# EasyEDA Pro project ProProject_AT_START_M416_V1.1.epro, board AT-START-M416-V1.1
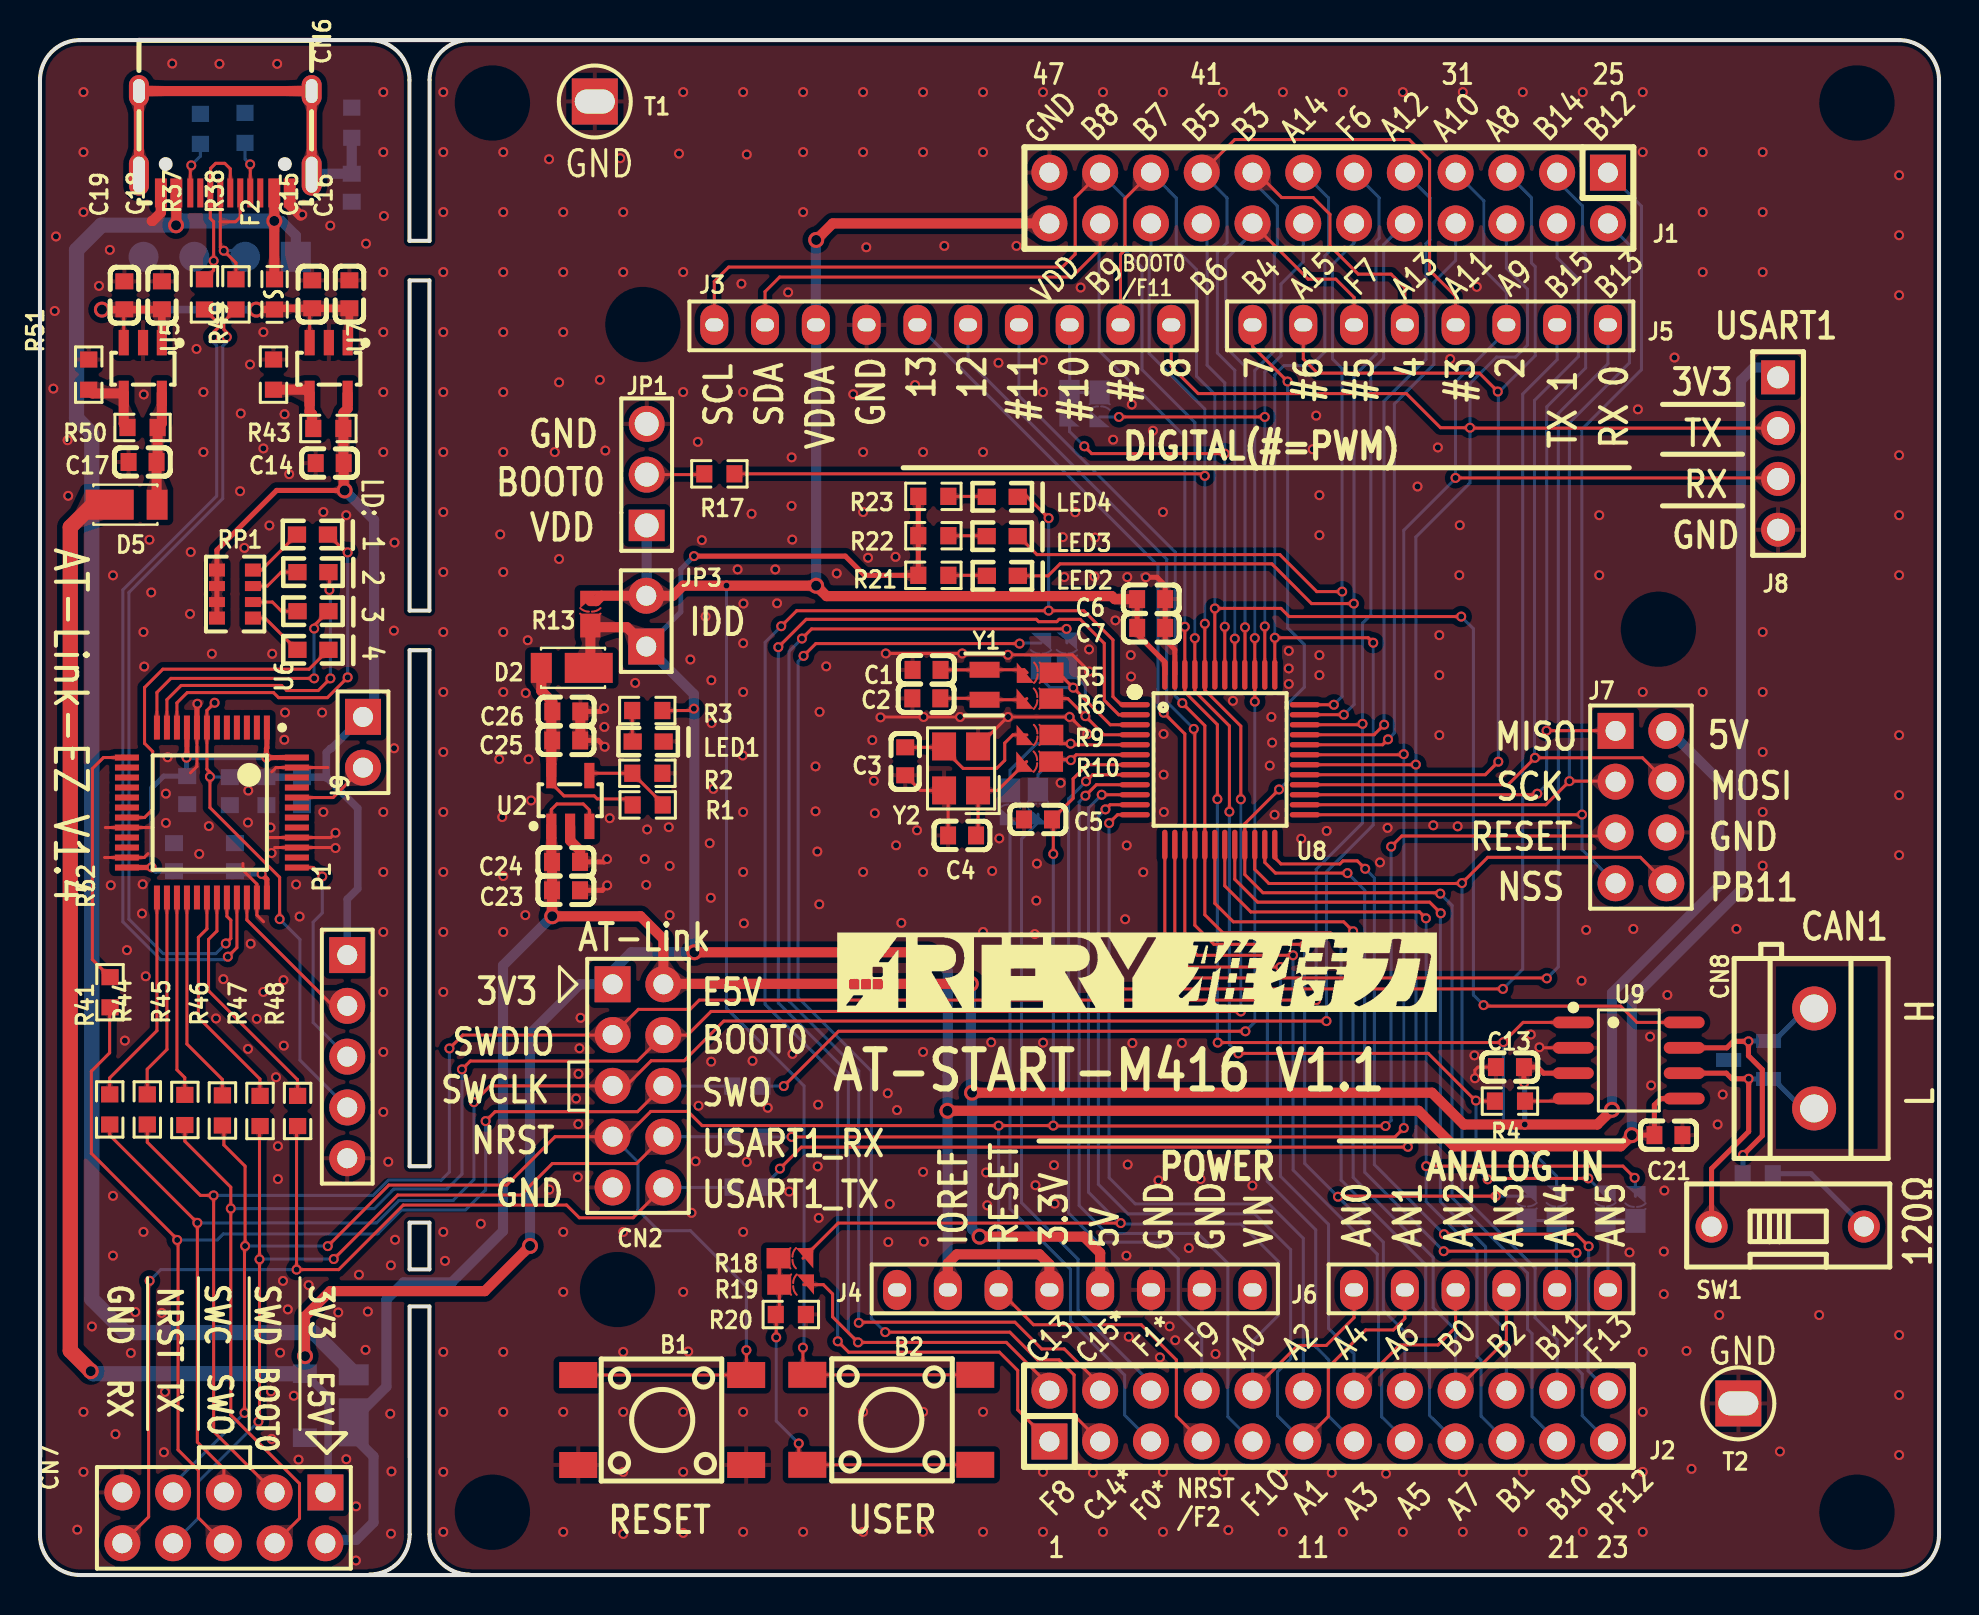
[diagram p4: board, top side]
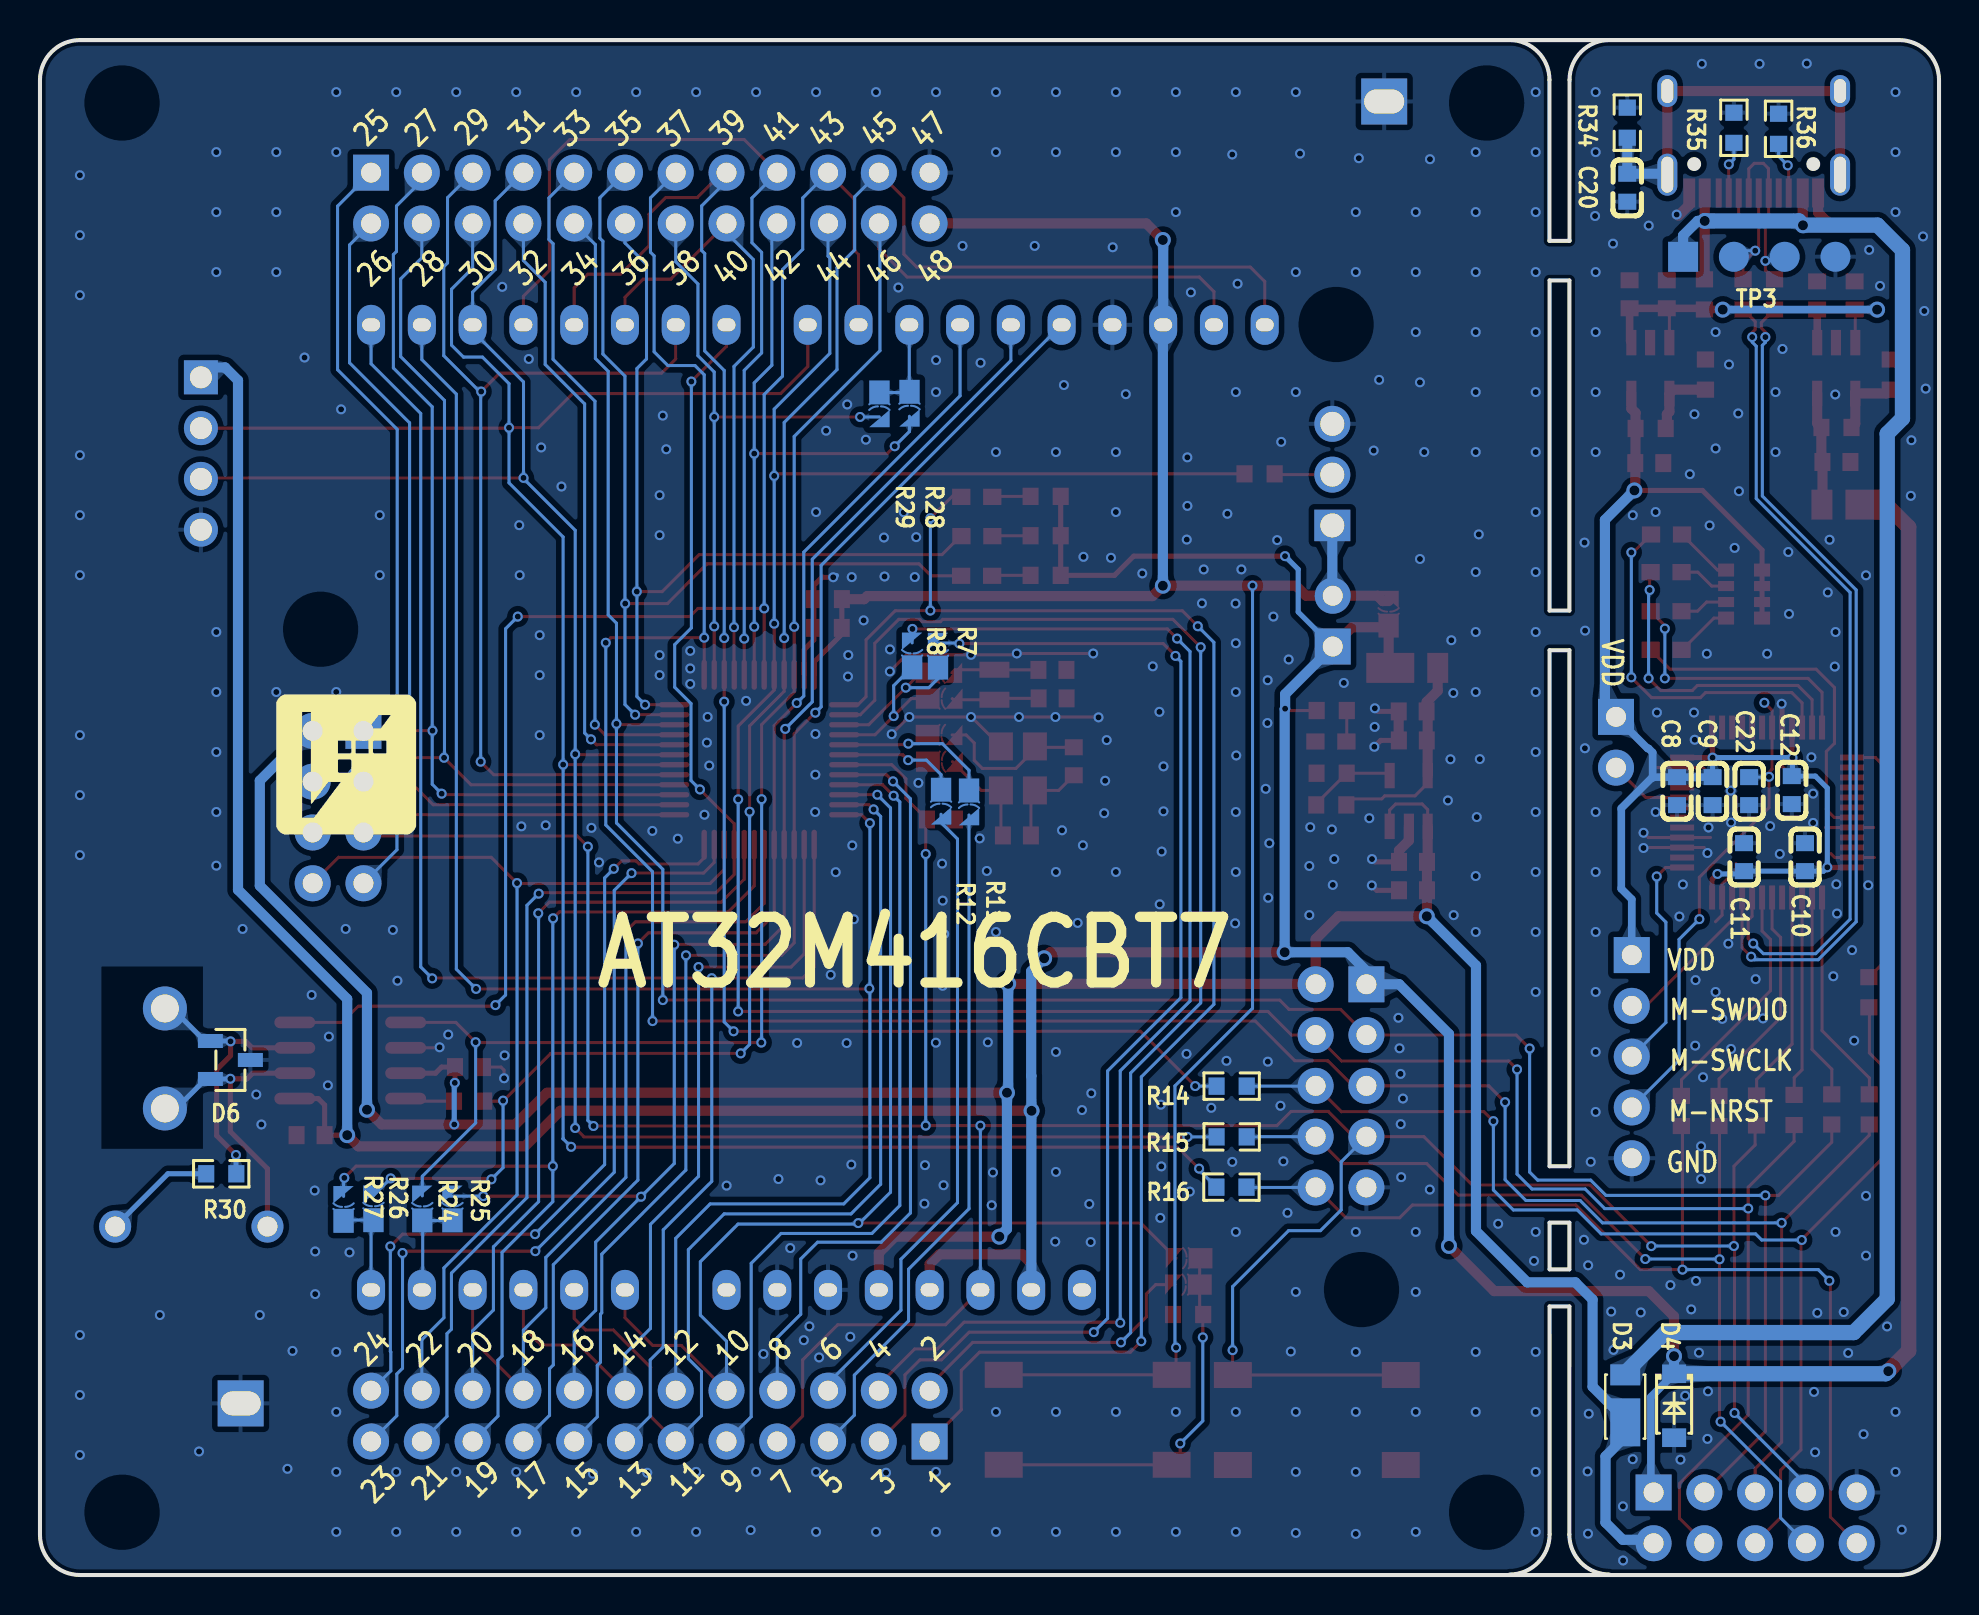
[diagram p5: board, bottom side, seen from below]

Outline 95 x 76.76 mm; copper layers: Top Layer, Bottom Layer. Coordinates in mm from the lower left corner of the outline.
Outline path: 16.48,76.76 arc(17.9,76.18) 18.48,74.76 18.48,66.72 19.49,66.72 19.49,74.76 arc(20.07,76.18) 21.49,76.76 ; 16.49,0.03 arc(17.91,0.61) 18.49,2.03 18.49,13.43 19.48,13.43 19.48,2.03 arc(20.07,0.61) 21.48,0.02 ; 0,74.76 0,2 arc(0.59,0.59) 2,0 93,0 arc(94.41,0.59) 95,2 95,74.76 arc(94.41,76.17) 93,76.76 2,76.76 arc(0.59,76.17) 0,74.76 ; 18.49,64.74 19.48,64.74 19.48,48.23 18.49,48.23 18.49,64.74 ; 18.49,46.25 19.48,46.25 19.48,20.44 18.49,20.44 18.49,46.25 ; 18.49,17.62 19.48,17.62 19.48,15.29 18.49,15.29 18.49,17.62
Stack: Top Layer 0.0356mm / Dielectric1 0.32mm FR-4 er 4.8 / Bottom Layer 0.0356mm

## Design rules (mm)
template: 自定义配置
spacing copperThickness1oz (default): track to track 0.152, other pairs 0.152 to 0.3
track width copperThickness1oz (default): min 0.127, default 0.152, max 2.54
differential pair differentialPair (default): width min 0.127, default 0.254, max 2.54; gap min 0.152, default 0.152
via viaSize (default): diameter min 0.5, default 0.5, max 1.001; hole min 0.3, default 0.3, max 0.701

## Placement (name value [footprint] x y rotation side)
B1  TS-1002S-05026C  [KEY-SMD_4P-L6.0-W6.0-P4.50-LS9.0]  31.12 7.75 0 top
B2  TSA063G60-250  [KEY-SMD_4P-L6.1-W6.1-P4.50-LS9.0]  42.59 7.76 180 top
C1  18pF  [C0603]  44.35 45.26 0 top
C2  18pF  [C0603]  44.34 43.84 0 top
C3  15pF  [C0603]  43.28 40.69 90 top
C4  15pF  [C0603]  46.13 36.98 0 top
C5  100nF  [C0603]  49.92 37.78 0 top
C6  4.7uF  [C0603]  55.58 48.8 180 top
C7  100nF  [C0603]  55.59 47.37 180 top
C8  4.7uF  [C0603]  13.11 39.2 90 bottom
C9  100nF  [C0603]  11.33 39.2 90 bottom
C10  100nF  [C0603]  6.7 35.9 270 bottom
C11  100nF  [C0603]  9.75 35.9 270 bottom
C12  100nF  [C0603]  7.37 39.25 90 bottom
C13  100nF  [C0603]  73.53 25.4 0 top
C14  10uF  [C0603]  14.49 55.6 0 top
C15  10uF  [C0603]  13.62 64.04 270 top
C16  100nF  [C0603]  15.48 64.05 270 top
C17  10uF  [C0603]  5.13 55.66 0 top
C18  10uF  [C0603]  6.1 63.99 270 top
C19  100nF  [C0603]  4.22 63.99 270 top
C20  100nF  [C0603]  15.59 69.38 90 bottom
C21  100nF  [C0603]  81.46 22 180 top
C22  100nF  [C0603]  9.5 39.2 90 bottom
C23  10uF  [C0603]  26.31 34.24 0 top
C24  100nF  [C0603]  26.31 35.66 0 top
C25  10uF  [C0603]  26.32 41.74 0 top
C26  100nF  [C0603]  26.33 43.19 0 top
CN2  CON10  [HDR2X5]  28.64 29.54 270 top
CN6  -  [USB-C-SMD_TYPEC-304-BCP16]  9.27 71.66 180 top
CN7  CON10  [HDR2X5]  14.28 4.13 180 top
CN8  KF301-5.0-2P  [CONN-TH_P5.00_KF301-5.0-2P]  88.75 25.83 90 top
D2  DFLS130L-7  [POWERDI-123_L2.8-W1.8-LS3.7-RD]  26.26 45.36 180 top
D3  DFLS130L-7  [POWERDI-123_L2.8-W1.8-LS3.7-RD]  15.7 8.82 90 bottom
D4  SMF3.3A  [SOD-123FL_L2.8-W1.8-LS3.8-RD]  13.25 8.47 270 bottom
D5  DFLS130L-7  [POWERDI-123_L2.8-W1.8-LS3.7-RD]  4.67 53.53 0 top
D6  PESD2CANFD24V-TR  [SOT-23-3_L2.9-W1.3-P1.90-LS2.4-BR]  85.47 25.76 0 bottom
F2  BSMD0603-050-6V  [F0603]  11.73 64.04 270 top
J1  Header 12X2  [HEAD2*12]  78.43 70.13 180 top
J2  Header 12X2  [HEAD2*12]  50.49 6.68 0 top
J3  CON10  [HDR1X10 - 2#]  56.59 62.52 180 top
J4  CON8  [HDR1X8 - 2#]  42.87 14.26 0 top
J5  CON8  [HDR1X8 - 2#]  78.43 62.52 180 top
J6  CON6  [HDR1X6 -2#]  65.73 14.26 0 top
J7  Header 4X2  [HDR2X4]  78.81 42.21 270 top
J8  PZ2.54-1*4-WZ  [HDR-TH_4P-P2.54-H-M-W7.7-P]  86.95 56.08 270 top
J9  1X2P_2.54M  [HDR1X2]  16.16 42.91 270 top
JP1  2.54-1*3P针  [HDR-TH_3P-P2.54-V-M-1]  30.35 55.03 90 top
JP3  1X2P_2.54M  [HDR1X2]  30.33 46.43 90 top
LD1  RED  [LED0603]  12.86 52.03 0 top
LD2  GREEN  [LED0603]  12.88 50.15 0 top
LD3  BLUE  [LED0603]  12.88 48.19 0 top
LD4  YELLOW  [LED0603]  12.88 46.26 0 top
LED1  RED  [LED0603]  29.65 41.68 0 top
LED2  RED  [LED0603]  47.37 49.96 0 top
LED3  YELLOW  [LED0603]  47.36 51.94 0 top
LED4  GREEN  [LED0603]  47.36 53.91 0 top
P1  Header 5  [HDR1X5]  15.37 31 270 top
R1  51kΩ  [R0603]  30.4 38.51 0 top
R2  15kΩ  [R0603]  30.38 40.09 0 top
R3  1kΩ  [R0603]  30.38 43.23 0 top
R4  330Ω  [R0603]  73.53 23.7 0 top
R5  0Ω  [SB-PAD_2]  50.02 45.12 0 top
R6  0Ω  [SB-PAD_2]  50.01 43.83 0 top
R7  NC  [SB-PAD_2]  50.07 45.96 270 bottom
R8  NC  [SB-PAD_2]  51.37 45.97 270 bottom
R9  0Ω  [SB-PAD_2]  50.01 42.01 0 top
R10  0Ω  [SB-PAD_2]  50 40.68 0 top
R11  NC  [SB-PAD_2]  48.52 38.65 90 bottom
R12  NC  [SB-PAD_2]  49.92 38.69 90 bottom
R13  0Ω  [SB-PAD_2]  27.53 48.06 270 top
R14  470Ω  [R0603]  35.38 24.45 180 bottom
R15  470Ω  [R0603]  35.39 21.91 180 bottom
R16  470Ω  [R0603]  35.4 19.4 180 bottom
R17  3.3kΩ  [R0603]  33.99 55.07 180 top
R18  0Ω  [SB-PAD_2]  37.52 15.84 180 top
R19  NC  [SB-PAD_2]  37.56 14.52 180 top
R20  100kΩ  [R0603]  37.56 13.03 0 top
R21  1kΩ  [R0603]  44.69 49.99 180 top
R22  1kΩ  [R0603]  44.69 51.97 180 top
R23  1kΩ  [R0603]  44.69 53.94 180 top
R24  NC  [SB-PAD_2]  75.87 18.31 270 bottom
R25  0Ω  [SB-PAD_2]  74.36 18.31 270 bottom
R26  NC  [SB-PAD_2]  78.31 18.32 270 bottom
R27  0Ω  [SB-PAD_2]  79.81 18.29 270 bottom
R28  NC  [SB-PAD_2]  51.5 58.59 90 bottom
R29  0Ω  [SB-PAD_2]  53.01 58.56 90 bottom
R30  120Ω  [R0603]  85.93 20.07 180 bottom
R34  1MΩ  [R0603]  15.59 72.63 90 bottom
R35  5.1kΩ  [R0603]  10.26 72.37 90 bottom
R36  5.1kΩ  [R0603]  8.03 72.32 90 bottom
R37  0Ω  [R0603]  8.23 64.04 270 top
R38  0Ω  [R0603]  9.8 64.04 270 top
R41  33Ω  [R0603]  3.49 23.28 270 top
R43  47kΩ  [R0603]  14.43 57.34 180 top
R44  33Ω  [R0603]  5.37 23.28 270 top
R45  33Ω  [R0603]  7.25 23.26 270 top
R46  33Ω  [R0603]  9.13 23.23 270 top
R47  33Ω  [R0603]  11.01 23.21 270 top
R48  33Ω  [R0603]  12.89 23.21 270 top
R49  15kΩ  [R0603]  11.68 60.03 90 top
R50  51kΩ  [R0603]  5.13 57.39 180 top
R51  15kΩ  [R0603]  2.44 60.03 90 top
R52  33Ω  [R0603]  3.5 29.14 270 top
RP1  1kΩ  [RES-ARRAY-SMD_0603-8P-L3.2-W1.6-BL]  9.75 49.06 270 top
SW1  DSWB01LHGET  [SW-TH_DSWB01LHGET]  87.43 17.42 90 top
T1  Test point  [TestPoint]  27.75 73.69 0 top
T2  Test point  [TestPoint]  84.96 8.58 0 top
TP3  1X4P_2.54F  [HDR1X4 - TOP]  12.8 65.92 0 bottom
U2  RT9080N-08GJ5  [SOT-23-5]  28.12 39.09 90 top
U5  RT9080N-08GJ5  [SOT-23-5]  3.56 59.98 270 top
U6  AT32F403ACCT7  [LQFP48 - 2]  11.35 42.38 270 top
U7  RT9080N-08GJ5  [SOT-23-5]  12.85 59.98 270 top
U8  -  [LQFP-48_L7.0-W7.0-P0.50-LS9.0-BL]  59.02 40.77 270 top
U9  MCP2562FD-E/SN  [SOIC-8_L4.9-W3.9-P1.27-LS6.0-BL]  79.48 25.73 270 top
Y1  32.768KHz  [XTAL_SOP - FC-12M]  47.25 45.27 270 top
Y2  8MHz  [CRYSTAL-SMD_4P-L3.2-W2.5-BL]  46.08 40.34 90 top

## Footprints (pads in the part's own frame, mm; a bottom-side part is the same pattern mirrored in y, then rotated)
C0603
  rect 0.8x0.9 smd: 1(-0.7,0) 2(0.7,0)
CONN-TH_P5.00_KF301-5.0-2P
  round 2.2 hole 1.4: 1(-2.5,0) 2(2.5,0)
CRYSTAL-SMD_4P-L3.2-W2.5-BL
  rect 1.4x1.2 smd: 1(-1.1,-0.85) 2(1.1,-0.85) 3(1.1,0.85) 4(-1.1,0.85)
F0603
  rect 0.806x0.864 smd: 1(-0.753,0) 2(0.753,0)
HDR1X2
  rect 1.8x1.8 hole 1: 1(0,0)
  round 1.8 hole 1: 2(2.54,0)
HDR1X4 - TOP
  rect 1.5x1.5 smd: 1(0,0)
  round 1.5 smd: 2(-2.54,0) 3(-5.08,0) 4(-7.62,0)
HDR1X5
  rect 1.8x1.8 hole 1: 1(0,0)
  round 1.8 hole 1: 2(2.54,0) 3(5.08,0) 4(7.62,0) 5(10.16,0)
HDR1X6 -2#
  oval 1.4x2 hole 0.9x0.65: 1(0,0) 2(2.54,0) 3(5.08,0) 4(7.62,0) 5(10.16,0) 6(12.7,0)
HDR1X8 - 2#
  oval 1.4x2 hole 0.9x0.65: 1(0,0) 2(2.54,0) 3(5.08,0) 4(7.62,0) 5(10.16,0) 6(12.7,0) 7(15.24,0) 8(17.78,0)
HDR1X10 - 2#
  oval 1.4x2 hole 0.9x0.65: 1(0,0) 2(2.54,0) 3(5.08,0) 4(7.62,0) 5(10.16,0) 6(12.7,0) 7(15.24,0) 8(17.78,0) 9(20.32,0) 10(22.86,0)
HDR2X4
  rect 1.8x1.8 hole 1: 1(0,0)
  round 1.8 hole 1: 2(0,2.54) 3(2.54,0) 4(2.54,2.54) 5(5.08,0) 6(5.08,2.54) 7(7.62,0) 8(7.62,2.54)
HDR2X5
  rect 1.8x1.8 hole 1: 1(0,0)
  round 1.8 hole 1: 2(0,2.54) 3(2.54,0) 4(2.54,2.54) 5(5.08,0) 6(5.08,2.54) 7(7.62,0) 8(7.62,2.54) 9(10.16,0) 10(10.16,2.54)
HDR-TH_3P-P2.54-V-M-1
  rect 1.575x1.8 hole 1.2: 1(-2.54,0)
  round 1.8 hole 1.2: 2(0,0) 3(2.54,0)
HDR-TH_4P-P2.54-H-M-W7.7-P
  rect 1.7x1.7 hole 1.1: 1(-3.81,0)
  round 1.7 hole 1.1: 2(-1.27,0) 3(1.27,0) 4(3.81,0)
HEAD2*12
  rect 1.8x1.8 hole 1: 1(0,0)
  round 1.8 hole 1: 2(0,2.54) 3(2.54,0) 4(2.54,2.54) 5(5.08,0) 6(5.08,2.54) 7(7.62,0) 8(7.62,2.54) 9(10.16,0) 10(10.16,2.54) 11(12.7,0) 12(12.7,2.54) 13(15.24,0) 14(15.24,2.54) 15(17.78,0) 16(17.78,2.54) 17(20.32,0) 18(20.32,2.54) 19(22.86,0) 20(22.86,2.54) 21(25.4,0) 22(25.4,2.54) 23(27.94,0) 24(27.94,2.54)
KEY-SMD_4P-L6.0-W6.0-P4.50-LS9.0
  rect 1.9x1.3 smd: 1(-4.2,2.25) 2(4.2,2.25) 3(-4.2,-2.25) 4(4.2,-2.25)
KEY-SMD_4P-L6.1-W6.1-P4.50-LS9.0
  rect 1.9x1.3 smd: 1(-4.2,2.25) 2(4.2,2.25) 3(-4.2,-2.25) 4(4.2,-2.25)
LED0603
  rect 0.914x0.813 smd: 1(-0.001,0.005) 2(1.548,0.005)
LQFP48 - 2
  rect 1.2x0.3 smd: 1(0,0) 2(0,-0.5) 3(0,-1) 4(0,-1.5) 5(0,-2) 6(0,-2.5) 7(0,-3) 8(0,-3.5) 9(0,-4) 10(0,-4.5) 11(0,-5) 12(0,-5.5) 25(8.5,-5.5) 26(8.5,-5) 27(8.5,-4.5) 28(8.5,-4) 29(8.5,-3.5) 30(8.5,-3) 31(8.5,-2.5) 32(8.5,-2) 33(8.5,-1.5) 34(8.5,-1) 35(8.5,-0.5) 36(8.5,0)
  rect 0.3x1.2 smd: 13(1.5,-7) 14(2,-7) 15(2.5,-7) 16(3,-7) 17(3.5,-7) 18(4,-7) 19(4.5,-7) 20(5,-7) 21(5.5,-7) 22(6,-7) 23(6.5,-7) 24(7,-7) 37(7,1.5) 38(6.5,1.5) 39(6,1.5) 40(5.5,1.5) 41(5,1.5) 42(4.5,1.5) 43(4,1.5) 44(3.5,1.5) 45(3,1.5) 46(2.5,1.5) 47(2,1.5) 48(1.5,1.5)
LQFP-48_L7.0-W7.0-P0.50-LS9.0-BL
  oval 0.269x1.501 smd: 1(-2.751,-4.25) 2(-2.251,-4.25) 3(-1.75,-4.25) 4(-1.25,-4.25) 5(-0.75,-4.25) 6(-0.249,-4.25) 7(0.249,-4.25) 8(0.75,-4.25) 9(1.25,-4.25) 10(1.75,-4.25) 11(2.251,-4.25) 12(2.751,-4.25) 25(2.751,4.25) 26(2.251,4.25) 27(1.75,4.25) 28(1.25,4.25) 29(0.75,4.25) 30(0.249,4.25) 31(-0.249,4.25) 32(-0.75,4.25) 33(-1.25,4.25) 34(-1.75,4.25) 35(-2.251,4.25) 36(-2.751,4.25)
  oval 1.501x0.269 smd: 13(4.25,-2.751) 14(4.25,-2.251) 15(4.25,-1.75) 16(4.25,-1.25) 17(4.25,-0.75) 18(4.25,-0.249) 19(4.25,0.249) 20(4.25,0.75) 21(4.25,1.25) 22(4.25,1.75) 23(4.25,2.251) 24(4.25,2.751) 37(-4.25,2.751) 38(-4.25,2.251) 39(-4.25,1.75) 40(-4.25,1.25) 41(-4.25,0.75) 42(-4.25,0.249) 43(-4.25,-0.249) 44(-4.25,-0.75) 45(-4.25,-1.25) 46(-4.25,-1.75) 47(-4.25,-2.251) 48(-4.25,-2.751)
POWERDI-123_L2.8-W1.8-LS3.7-RD
  rect 2.4x1.5 smd: 1(-1.188,0)
  rect 1.05x1.5 smd: 2(1.188,0)
R0603
  rect 0.806x0.864 smd: 1(-0.753,0) 2(0.753,0)
RES-ARRAY-SMD_0603-8P-L3.2-W1.6-BL
  rect 0.65x0.8 smd: 1(-1.2,-0.9) 4(1.2,-0.9) 5(1.2,0.9) 8(-1.2,0.9)
  rect 0.5x0.8 smd: 2(-0.4,-0.9) 3(0.4,-0.9) 6(0.4,0.9) 7(-0.4,0.9)
SB-PAD_2
  custom 1.042x1.016 smd: 1(-0.64,-0.002)
  custom 1.194x1.016 smd: 2(0.579,-0.002)
SOD-123FL_L2.8-W1.8-LS3.8-RD
  rect 0.93x1.2 smd: 1(-1.6,0) 2(1.6,0)
SOIC-8_L4.9-W3.9-P1.27-LS6.0-BL
  oval 0.588x2.045 smd: 1(-1.905,-2.772) 2(-0.635,-2.772) 3(0.635,-2.772) 4(1.905,-2.772) 5(1.905,2.772) 6(0.635,2.772) 7(-0.635,2.772) 8(-1.905,2.772)
SOT-23-3_L2.9-W1.3-P1.90-LS2.4-BR
  rect 1.25x0.7 smd: 1(1,-0.95) 2(1,0.95) 3(-1,0)
SOT-23-5
  rect 1.27x0.508 smd: 1(-1.651,2.54) 2(-1.651,1.6) 3(-1.651,0.635) 4(0.889,0.635) 5(0.889,2.54)
SW-TH_DSWB01LHGET
  round 1.6 hole 1: 1(0,3.81) 2(0,-3.81)
TestPoint
  rect 2.3x2.3 hole 2x1.2: 1(0,0)
USB-C-SMD_TYPEC-304-BCP16
  oval 1.001x2.1 hole 0.6x1.801: 13(-4.321,1.633) 14(4.321,1.633)
  oval 1.001x1.6 hole 0.6x1.199: 15(-4.321,-2.547) 16(4.321,-2.547)
  rect 0.6x1.45 smd: A1B12(-3.226,2.547) A4B9(-2.451,2.547) B1A12(3.22,2.547) B4A9(2.451,2.547)
  rect 0.299x1.45 smd: A5(-1.25,2.547) A6(-0.249,2.547) A7(0.249,2.547) A8(1.25,2.547) B5(1.75,2.547) B6(0.75,2.547) B7(-0.75,2.547) B8(-1.75,2.547)
XTAL_SOP - FC-12M
  rect 0.8x1.5 smd: 1(0,0) 2(1.5,0)

## Nets
As in the schematic.

Pads without a net: CN6 A8 B8; J4 1 8; U6 2 3 4 5 6 14 15 16 17 18 21 22 29 38 41 42 43 45 46

## Via types
v1: diameter 0.8, hole 0.5, Top Layer to Bottom Layer, 19 vias
v2: diameter 0.5, hole 0.299, Top Layer to Bottom Layer, 111 vias
v3: diameter 0.5, hole 0.3, Top Layer to Bottom Layer, 541 vias

## Routing (per net, layer and track width the routed paths; a pad name or vN(x,y) marks a point on that pad's centre or on a via; arc(x,y) is an arc through that point)
3V3: length 262.2
  Top Layer w0.152: v3(32.71,43.32) 32.62,43.23 R3.2
  Top Layer w0.254: 43.94,54.11 43.94,49.99 41.25,49.99 40.28,50.95 v2(32.72,50.95) ; U9.5 81.08,23.83 80.76,23.51 C21.2 v1(79.63,22)
  Top Layer w0.508: JP3.1 29.36,47.4 27.62,47.4 27.53,47.49 27.53,45.45 D2.1 ; 45.4,23.22 68.96,23.22 70.74,21.44 79.07,21.44 v1(79.63,22) ; v1(44.77,30.84) 44.46,31.14 v1(32.73,31.14) ; 45.41,14.26 45.41,15.59 45.86,16.04 50,16.04 50.49,15.54 J4.4 ; v1(13.26,10.95) 13.26,12.94 14.52,14.2 22.25,14.2 v1(24.51,16.46)
  Top Layer w0.762: v1(2.54,10.19) 1.52,11.22 1.52,52.4 2.64,53.53 D5.1
  Bottom Layer w0.254: v2(32.72,50.95) 32.06,50.29 32.06,48.16 JP3.1
  Bottom Layer w0.381: CN7.1 14.41,4.26 14.41,8.9 D4.1
  Bottom Layer w0.508: v1(79.63,22) 79.63,28.8 85.09,34.27 85.09,59.74 85.74,60.39 86.45,60.39 J8.1 ; JP3.1 32.71,44.05 v3(32.71,43.32) 32.73,43.3 v1(32.73,31.14) 29.57,31.14 28.64,30.21 CN2.1 27,29.54 24.51,27.05 v1(24.51,16.46) ; 45.41,14.26 45.4,14.27 45.4,24.96 45.41,24.97 45.41,30.19 v1(44.77,30.84) ; D4.1 13.26,10.07 v1(13.26,10.95)
  Bottom Layer w0.762: D4.1 2.67,10.06 v1(2.54,10.19)
  vias: v1(45.4,23.21)
GND: length 70.1
  Top Layer w0.152: C13.1 71.93,25.4 71.78,25.25 v2(71.78,24.84) ; 10.15,35.58 10.15,35.25 10.85,34.55 U6.35 10.85,33 11.18,32.67 ; U6.8 7.85,40.43 7.53,40.11 ; 14.4,40.38 U6.47 11.81,40.38 11.59,40.17 ; v2(52.48,45.18) 51.65,46.02 v2(48.42,46.02) 46.2,46.02 v2(46.13,46.08) v2(42.31,46.08) ; C3.1 44.04,39.24 Y2.4 45.43,39.03 C4.1 ; v2(52.39,42.05) 51.73,42.71 51.73,42.72 51.54,42.91 v2(51.51,42.91) v3(48.42,42.91) 48.4,42.91 ; 3.23,35.88 U6.23 5.21,35.88 5.41,36.08 ; 11.74,36.38 U6.39 14.76,36.38 v3(14.78,36.36) ; 48.4,42.91 v2(46.02,42.91) v2(44.2,42.91) 42.06,42.91 v2(42.04,42.89) ; 48.4,42.91 46.93,41.44 ; v2(75.01,26.39) 75.03,26.37 U9.2 ; 11.43,36.88 U6.40 14.55,36.88 v3(14.78,37.12) ; 3.27,37.38 U6.20 5.68,37.38
  Top Layer w0.254: v2(28.25,41.42) 27.93,41.74 C25.2 ; v2(28.37,34.49) 28.13,34.24 C23.2 ; v3(28.22,43.34) 28.06,43.19 C26.2 ; v2(28.37,35.8) 28.22,35.66 C24.2 ; C7.1 56.28,46.76 56.77,46.28 U8.47 ; v3(7.87,43.57) 7.85,43.55 U6.8 ; v3(55.32,49.9) 55.88,49.9 56.28,49.49 C6.1 56.28,47.37
  Top Layer w0.508: U2.2 26.52,36.73 27.01,36.23 C24.2 ; CN6.B1A12 6.05,68.13 5.63,67.71 5.59,67.71 ; 13.04,67.98 12.5,68.52 CN6.A1B12 ; C26.2 27.03,41.75 C25.2
  Bottom Layer w0.254: v3(55.32,49.9) 55.24,49.9 55.15,49.99
  vias: v2(28.23,42.41) v2(28.5,37.85) v2(29.77,44.61) v2(33.6,42.61) v2(33.68,39.32) v2(34.9,50.29) v2(35.6,53.07) v2(36.78,50.29) v2(37.64,26.06) v2(39.86,50.09) v2(53.8,47.74) v2(54.56,46) v2(54.58,44.93) v2(64,54) v2(64,52) v2(64,46) v2(64,45) v2(64.36,37.21) v2(67.03,35.64) v2(67.41,37.36) v2(68.91,54.43) v2(69.7,37.49) v2(69.93,56.39) v2(70,47) v2(70,45) v2(70,42) v2(71,50) v2(70.92,37.44) v2(71.02,52.5) v2(71.75,25.98) v2(74.57,27.03) v2(77.11,29.72) v2(77.34,32.26) v2(78,53) v2(78,50) v2(79.71,32.31) v2(79.93,58.29) v2(80.54,26.92) v2(80.59,24.49) v2(81.25,19.23) v2(81.23,16.18) v2(81.23,14.05) v2(81.41,29.01) v2(81.76,60.88) v2(83.92,22.53) v2(84,13) v2(84.18,24.03) v2(84.86,32.31) v2(89,13) v3(0.67,59.33) v3(0.8,66.94) v3(0.74,63.21) v3(1.38,56.75) v3(1.41,53.97) v3(1.86,2.27) v3(2.18,74.16) v3(2.18,71.16) v3(2.18,68.16) v3(2.18,8.16) v3(2.18,5.16) v3(2.6,12.43) v3(2.95,64.47) v3(3.49,66.27) v3(3.54,34.49) v3(3.65,49.99) v3(3.65,18.96) v3(3.65,15.97) v3(3.78,7.04) v3(4.25,26.72) v3(4.35,31.25) v3(4.55,11.1) v3(4.77,13.15) v3(5.19,59.04) v3(5.18,47.16) v3(5.14,34.54) v3(5.1,33.08) v3(5.18,17.16) v3(5.21,45.43) v3(5.29,29.94) v3(5.48,51.77) v3(5.56,49.14) v3(6.09,13.11) v3(6.2,6.14) v3(6.3,39.08) v3(6.3,37.61) v3(6.25,9.16) v3(6.39,40.89) v3(6.62,75.59) v3(7.54,51.16) v3(7.51,48.06) v3(7.83,61.31) v3(7.97,36.06) v3(8.18,59.16) v3(8.18,56.16) v3(8.45,37.45) v3(8.6,46.07) v3(8.81,27.83) v3(8.98,75.57) v3(9.17,29.8) v3(10.04,58.09) v3(10.01,54.2) v3(10.22,51.37) v3(10.42,39.23) v3(10.4,37.63) v3(10.41,26.31) v3(10.51,60.54) v3(10.54,31.57) v3(10.84,27.81) v3(11.18,62.16) v3(11.18,56.34) v3(11.18,29.16) v3(11.48,52.49) v3(11.53,37.38) v3(11.59,36.1) v3(11.56,9.19) v3(11.58,6.81) v3(11.62,46.07) v3(11.86,75.57) v3(11.81,24.89) v3(11.9,21.44) v3(11.9,19.8) v3(12.01,11.12) v3(12.18,29.75) v3(12.2,26.47) v3(12.16,14.71) v3(12.24,58.05) v3(12.26,43.13) v3(12.22,41.77) v3(12.4,13.28) v3(12.47,55.05) v3(12.7,8.96) v3(12.81,34.53) v3(12.99,32.93) v3(12.93,5.77) v3(13.12,68.03) v3(13.44,14.5) v3(14.18,53.16) v3(14.11,43.13) v3(14.18,38.16) v3(14.52,67.48) v3(14.92,13.13) v3(15.32,53) v3(15.32,5.79) v3(15.81,3.44) v3(15.81,0.73) v3(15.96,15.02) v3(16.29,11.26) v3(16.31,66.58) v3(16.4,13.17) v3(17.18,74.16) v3(17.18,71.16) v3(17.18,65.16) v3(17.18,62.16) v3(17.18,59.16) v3(17.18,56.16) v3(17.18,38.16) v3(17.18,35.16) v3(17.18,32.16) v3(17.18,29.16) v3(17.18,26.16) v3(17.18,23.16) v3(17.21,67.96) v3(17.42,20.66) v3(17.55,15.49) v3(17.52,8.06) v3(17.58,5.18) v3(17.56,2.07) v3(17.73,51.63) v3(17.7,47.23) v3(17.71,41.35) v3(17.76,16.77) v3(20.18,74.16) v3(20.18,71.16) v3(20.18,68.16) v3(20.18,65.16) v3(20.18,62.16) v3(20.18,59.16) v3(20.18,56.16) v3(20.18,53.16) v3(20.18,50.16) v3(20.18,47.16) v3(20.18,44.16) v3(20.18,41.16) v3(20.18,38.16) v3(20.18,35.16) v3(20.18,32.16) v3(20.18,29.16) v3(20.18,17.16) v3(20.18,11.16) v3(20.18,8.16) v3(20.18,5.16) v3(20.18,2.16) v3(20.26,15.71) v3(22.05,17.56) v3(22.97,40.8) v3(23.02,52.04) v3(23.18,71.16) v3(23.18,68.16) v3(23.18,65.16) v3(23.18,62.16) v3(23.18,59.16) v3(23.18,56.16) v3(23.18,50.16) v3(23.18,47.16) v3(23.18,44.16) v3(23.12,37.9) v3(23.18,34.95) v3(23.18,32.16) v3(23.18,11.16) v3(23.18,8.16) v3(24.3,44.11) v3(24.28,33) v3(24.4,46.75) v3(24.44,40.79) v3(24.57,38.73) v3(25.46,70.8) v3(25.47,19.27) v3(25.75,56.16) v3(25.97,59.64) v3(25.97,50.81) v3(26.18,68.16) v3(26.18,65.16) v3(26.18,62.16) v3(26.18,17.16) v3(26.18,14.16) v3(26.18,8.16) v3(26.18,2.16) v3(26.82,23.83) v3(26.99,26.34) v3(26.94,25.06) v3(26.93,22.55) v3(26.91,19.9) v3(27.04,27.87) v3(28.01,59.77) v3(28.28,56.23) v3(29.02,70.85) v3(29.18,68.16) v3(29.18,65.16) v3(29.18,17.16) v3(29.18,11.16) v3(29.18,8.16) v3(29.18,5.16) v3(29.18,2.06) v3(30.25,35.81) v3(30.37,37.29) v3(30.33,34.51) v3(31.45,37.4) v3(31.5,35.46) v3(31.5,33) v3(31.97,71.08) v3(32.18,74.16) v3(32.18,65.16) v3(32.18,59.16) v3(32.18,14.16) v3(32.18,8.16) v3(32.18,5.16) v3(32.18,2.11) v3(32.43,11.18) v3(32.53,45.78) v3(32.59,18.11) v3(32.8,20.69) v3(32.91,56.67) v3(32.94,23.47) v3(33.11,51.75) v3(33.3,47.93) v3(33.5,36.6) v3(33.58,44.75) v3(33.56,33.87) v3(33.58,25.67) v3(35.09,64.57) v3(35.18,74.16) v3(35.18,59.16) v3(35.19,48.58) v3(35.18,46.6) v3(35.18,44.16) v3(35.16,40.98) v3(35.18,38.16) v3(35.18,35.16) v3(35.18,17.16) v3(35.18,8.16) v3(35.18,2.16) v3(35.21,32.59) v3(35.36,71.04) v3(35.35,20.66) v3(35.64,25.71) v3(36.41,23.36) v3(36.87,48.59) v3(37.42,64.14) v3(37.48,19.17) v3(37.6,55.89) v3(37.6,53.47) v3(37.63,51.78) v3(38.18,74.16) v3(38.18,71.16) v3(38.18,68.16) v3(38.18,8.16) v3(38.18,2.16) v3(38.8,40.44) v3(38.8,38.19) v3(38.89,36.18) v3(39,43.17) v3(38.98,33.54) v3(38.93,23.52) v3(38.9,20.43) v3(38.95,17.86) v3(39.33,45.44) v3(40.68,59.05) v3(41.18,74.16) v3(41.18,71.16) v3(41.18,56.16) v3(41.18,53.16) v3(41.18,35.16) v3(41.18,8.16) v3(41.18,2.16) v3(41.34,66.4) v3(41.42,50.87) v3(41.64,41.75) v3(41.71,39.72) v3(41.76,38.1) v3(42.41,24.09) v3(42.44,16.65) v3(42.51,18.55) v3(42.8,50.92) v3(42.83,36.49) v3(42.87,23.25) v3(43.09,32.61) v3(43.77,59.51) v3(43.87,37.24) v3(44.18,74.16) v3(44.18,71.16) v3(44.18,56.16) v3(44.18,35.16) v3(44.18,26.16) v3(44.18,20.16) v3(44.18,8.16) v3(44.18,2.16) v3(44.21,16.67) v3(45.24,66.47) v3(47.18,74.16) v3(47.18,71.16) v3(47.18,56.16) v3(47.18,32.16) v3(47.18,8.16) v3(47.18,2.16) v3(47.33,20.13) v3(47.39,18.49) v3(47.58,26.64) v3(47.63,35.21) v3(47.95,60.62) v3(47.99,36.84) v3(48.85,66.47) v3(49.76,32.05) v3(49.8,19.49) v3(49.87,35.58) v3(49.84,33.73) v3(49.84,29.47) v3(50.18,74.16) v3(50.17,60.76) v3(50.18,59.16) v3(50.18,26.62) v3(50.18,5.16) v3(50.18,2.16) v3(50.72,20.5) v3(50.75,18.57) v3(51.06,39.61) v3(51.16,51.9) v3(51.24,49.91) v3(51.79,53.15) v3(52.06,64.39) v3(52.48,46.29) v3(52.67,5.12) v3(52.78,51.88) v3(52.75,49.93) v3(53.18,74.16) v3(53.18,2.16) v3(53.68,56.78) v3(54.28,32.79) v3(54.39,49.9) v3(54.36,36.49) v3(54.35,15.97) v3(54.41,20.52) v3(54.46,11.91) v3(54.62,58.54) v3(54.65,26.6) v3(55.19,35.15) v3(55.44,30.01) v3(55.67,57.22) v3(55.95,19.74) v3(56.02,10.88) v3(56.18,74.16) v3(56.18,53.16) v3(56.18,5.16) v3(56.18,2.16) v3(56.21,42.06) v3(56.21,40.02) v3(56.22,38.16) v3(56.51,12.43) v3(56.79,11.74) v3(57.12,26.61) v3(57.47,16.35) v3(58.06,19.8) v3(58.81,11.05) v3(59.18,74.16) v3(59.18,5.16) v3(59.45,2.25) v3(59.68,43.72) v3(60.65,19.47) v3(61.6,42.91) v3(61.52,40.48) v3(61.64,41.63) v3(61.76,38.02) v3(62.18,74.16) v3(62.18,5.16) v3(62.18,2.16) v3(62.47,46.22) v3(62.47,45.34) v3(62.47,44.56) v3(63.09,36.82) v3(63.67,56.3) v3(63.84,57.98) v3(64.62,5.11) v3(65.18,74.16) v3(65.18,2.16) v3(67.33,5.07) v3(68.18,74.16) v3(68.18,2.16) v3(70.54,60.81) v3(71.18,74.16) v3(71.18,5.16) v3(71.18,2.16) v3(71.87,64.42) v3(74.18,74.16) v3(74.18,5.16) v3(74.18,2.16) v3(77.18,74.16) v3(77.18,5.16) v3(77.18,2.16) v3(79.51,16.14) v3(80.18,74.16) v3(80.18,71.16) v3(80.18,44.16) v3(80.18,11.16) v3(80.18,8.16) v3(80.18,5.16) v3(80.18,2.16) v3(82.36,11.21) v3(82.62,5.31) v3(83.18,71.16) v3(83.18,68.16) v3(83.18,65.16) v3(83.18,44.16) v3(86.18,71.16) v3(86.18,68.16) v3(86.18,65.16) v3(86.18,47.16) v3(86.18,44.16) v3(86.18,41.16) v3(86.18,38.16) v3(86.18,35.47) v3(87.04,6.18) v3(93,70) v3(93,67) v3(93,64) v3(93,56) v3(93,53) v3(93,50) v3(93,42) v3(93,39) v3(93,36) v3(93,12) v3(93,9) v3(93,6)
VCC: length 69.4
  Top Layer w0.254: U6.9 7.35,40.89 v3(7.33,40.87) ; U6.1 11.35,41.36 11.33,41.34 v3(11.33,40.88) 11.86,40.88 11.86,40.88 U6.48 ; v3(11.08,35.06) 11.35,34.79 U6.36 ; v3(5.59,35.39) 5.58,35.38 U6.24 ; RP1.4 RP1.3 RP1.2 RP1.1 8.85,51.26 11.84,54.24 v1(15.24,54.24)
  Top Layer w0.508: v1(15.24,54.24) 15.19,54.28 C14.2 15.18,55.62 R43.1 15.18,58.12 15.39,58.33 U7.5
  Bottom Layer w0.254: C9.2 v3(11.33,40.88) 7.34,40.88 v3(7.33,40.87) 7.33,39.99 C12.2 6.19,39.95 5.59,39.35 v3(5.59,35.39) 5.78,35.2 C10.2 C11.2 9.89,35.06 v3(11.08,35.06)
  Bottom Layer w0.381: 14.32,39.87 14.29,39.9 C8.2 C9.2 ; 14.32,39.87 14.37,39.87 15.9,38.34 15.9,34.32 15.37,33.8 P1.1 ; 14.32,39.87 14.32,41.13 14.53,41.33 14.58,41.33 J9.1
  Bottom Layer w0.508: J9.1 16.71,43.47 16.71,52.76 v1(15.24,54.24)
VCC3.5V: length 5.7
  Top Layer w0.508: U5.5 6.09,57.6 R50.1 5.88,55.71 C17.2 5.83,53.56 D5.2
VDD: length 114.8
  Top Layer w0.152: v2(34.34,49.48) 34.34,49.48 34.33,49.47 ; v3(38.17,11.37) 38.17,10.23 B2.4 B2.3
  Top Layer w0.254: C7.2 54.88,47.05 56.27,45.66 U8.48 ; C6.2 54.88,47.37
  Top Layer w0.508: v1(38.83,66.76) 39.66,67.59 J1.24 ; 27.53,48.7 27.83,48.7 28.09,48.97 JP3.2 31.66,48.97 32.16,49.47 34.33,49.47 v1(38.83,49.47) 39.35,48.95 53.61,48.95 53.77,48.8 54.88,48.8 C6.2
  Bottom Layer w0.152: v3(38.17,11.37) 38.22,11.43 38.22,24.46 34.34,28.34 v2(34.34,49.48)
  Bottom Layer w0.508: v1(38.83,66.76) 38.81,66.74 J3.8 38.83,62.5 v1(38.83,49.47) ; JP3.2 30.35,48.99 30.35,49.49 ; 30.35,49.49 JP1.1 ; 30.35,49.49 30.37,49.47
ATLINK_5V: length 86.4
  Top Layer w0.508: F2.1 11.72,64.81 v1(11.72,67.72) CN6.A4B9 ; CN6.B4A9 6.82,67.51 v1(6.81,67.5)
  Bottom Layer w0.508: v1(6.81,67.5) 6.8,67.5 6.8,67.51 ; v1(11.72,67.72) 12.07,67.72 12.8,66.99 TP3.1
  Bottom Layer w0.762: v1(11.72,67.72) 7.01,67.72 6.8,67.51 3.08,67.51 1.83,66.26 1.83,57.84 2.59,57.08 2.59,13.8 4.27,12.12 13.68,12.12 15.7,10.11 D3.2
ATLK_BOOT0: length 10.1
  Top Layer w0.152: 7.24,23.99 7.24,24.87 6.85,25.26 U6.27
ATLK_NRST: length 10.6
  Top Layer w0.152: 9.12,23.97 9.12,24.78 7.35,26.55 U6.28
ATLK_RX: length 52.5
  Top Layer w0.152: CN2.10 29.67,17.87 26.98,17.87 26.34,18.5 18.17,18.5 14.94,15.27 v3(12.84,15.27) 12.83,22.4 R48.2 ; CN7.10 5.43,2.91 5.43,14.66 v3(5.49,14.72)
  Bottom Layer w0.152: CN2.10 34.63,19.38 R16.2 ; v3(12.84,15.27) 6.04,15.27 v3(5.49,14.72)
ATLK_SWCLK: length 10.8
  Top Layer w0.152: U6.25 5.85,27.22 3.48,24.85 3.48,24.02
ATLK_SWDIO: length 10.3
  Top Layer w0.152: U6.26 6.35,26.28 5.36,25.29 5.36,24.02
ATLK_SWO: length 12.8
  Top Layer w0.152: R52.1 2.62,30.78 2.62,40.32 3.18,40.88 U6.13
ATLK_TX: length 48.9
  Top Layer w0.152: v3(14.69,15.8) 17.89,19 24.05,19 25.63,20.58 29.84,20.58 CN2.8 ; R47.2 10.98,22.43 v3(10.98,15.79) 10.98,7.73 v3(10.93,7.67)
  Bottom Layer w0.152: CN7.8 7.93,2.86 7.93,4.67 v3(10.93,7.67) ; CN2.8 34,21.92 34.01,21.91 34.63,21.91 ; v3(10.98,15.79) 11,15.8 v3(14.69,15.8)
CAN1_RX: length 96.6
  Top Layer w0.152: v2(72.42,19.79) 72.46,19.83 v3(77.45,19.83) ; v3(57.77,46.85) U8.45 57.77,44.19 59.5,42.46 v3(59.5,38.17) ; R4.1 71.83,23.7 69.44,26.09 v2(59.94,26.09) ; J1.21 51.78,68.88 51.78,66.05 51.14,65.41 34.45,65.41 33.73,64.69 33.73,62.52
  Bottom Layer w0.152: v3(59.5,38.17) 59.5,26.53 v2(59.94,26.09) ; v3(77.45,19.83) 78.31,18.98 78.31,18.97 ; v2(71.83,23.72) 71.83,20.37 v2(72.42,19.79) ; J1.21 54.24,68.92 54.24,66.27 55.13,65.38 55.13,60.28 57.77,57.64 v3(57.77,46.85)
CAN1_STB: length 77.5
  Top Layer w0.152: J3.2 54.05,66.04 54.28,66.27 54.28,68.84 55.57,70.13 ; v2(72.21,28.5) 72.26,28.45 79.07,28.45 79.88,27.64 U9.8 ; U8.43 v2(58.77,48.34) 62.08,48.34 62.48,47.93 v2(71.09,47.93)
  Bottom Layer w0.152: v2(71.09,47.93) 71.7,47.32 71.7,29.01 v2(72.21,28.5) ; v2(58.77,48.34) 58.77,59.03 57.85,59.95 57.85,65.28 56.84,66.29 56.84,68.86 55.57,70.13
CAN1_TX: length 91
  Top Layer w0.152: v3(58.9,38.8) 58.9,42.53 57.27,44.15 U8.46 v3(57.27,47.42) ; J1.22 53.03,66.32 51.62,64.91 37,64.91 36.27,64.18 J3.9 ; 73.2,26.63 v2(58.91,26.63) ; v2(73.2,26.65) 74.19,27.64 U9.1
  Bottom Layer w0.152: 75.87,18.96 75.87,19.94 73.2,22.61 v2(73.2,26.65) ; J1.22 52.98,67.53 52.98,61.23 57.27,56.94 v3(57.27,47.42) ; v2(58.91,26.63) 58.9,26.64 v3(58.9,38.8)
CAN_H: length 14.6
  Top Layer w0.254: v2(85.19,21.01) 86.16,21.97 86.16,25.27 85.46,25.97 v2(85.46,26.69) 84.71,26.69 84.38,26.37 U9.7
  Bottom Layer w0.254: R30.2 85.19,20.08 v2(85.19,21.01) ; CN8.2 88.38,28.33 86.75,26.71 85.48,26.71 v2(85.46,26.69)
CAN_L: length 15.4
  Top Layer w0.254: U9.6 84.36,25.1 84.63,24.82 v2(85.47,24.82) 85.47,22.18 83.62,20.32 SW1.1
  Bottom Layer w0.254: v2(85.47,24.82) 85.48,24.81 86.7,24.81 88.17,23.33 CN8.1
CC1: length 2.6
  Top Layer w0.152: v3(10.51,70.54) 10.52,70.54 CN6.A5
  Bottom Layer w0.152: R35.1 10.26,70.8 v3(10.51,70.54)
CC2: length 2.7
  Top Layer w0.152: CN6.B5 7.52,70.45 v3(7.57,70.49)
  Bottom Layer w0.152: R36.1 8.03,70.95 v3(7.57,70.49)
E5V: length 153.2
  Top Layer w0.152: U2.1 25.58,38.28 25.86,38.56 27.18,38.56 27.48,38.25 U2.3
  Top Layer w0.254: v2(74.24,24.61) 74.22,24.64 74.23,24.65 C13.2 74.91,25.4 75.21,25.1 U9.3
  Top Layer w0.508: v1(46.62,24.12) 69.63,24.12 71.22,22.53 v2(74.27,22.53) 77.9,22.53 v1(78.64,23.27) ; v1(47.01,16.92) 52.22,16.92 53.03,16.1 J4.5 ; C24.1 25.58,35.7 U2.1 ; C24.1 25.67,35.72 25.71,35.72 25.66,35.66 C24.1 ; C24.1 C23.1 25.61,32.95 v1(25.62,32.94) 30.04,32.94 31.18,31.8 CN2.2 31.21,29.56 v1(46.56,29.56)
  Bottom Layer w0.254: v2(74.27,22.53) 74.27,24.58 v2(74.24,24.61)
  Bottom Layer w0.508: v1(47.01,16.92) 46.62,17.3 v1(46.62,24.12) 46.56,24.18 v1(46.56,29.56) ; J7.2 81.51,42.21 84,39.73 84,34.47 78.64,29.11 v1(78.64,23.27) ; v1(25.62,32.94) 23.16,30.48 23.16,17.2 20.6,14.64 18.19,14.64 17.33,13.77 17.33,9.42 15.7,7.78 D3.1 15.7,6.92 16.68,5.93 16.68,2.63 15.82,1.76 14.45,1.76 CN7.2
EGND: length 20.8
  Top Layer w0.508: CN6.14 CN6.16 CN6.15 CN6.13
  Bottom Layer w0.508: R34.1 C20.2 13.64,70.08 CN6.13
LD1: length 18.1
  Top Layer w0.152: v3(15.39,44.89) 14.38,43.87 11.94,43.87 11.68,44.13 7.37,44.13 6.85,43.61 U6.10 ; v3(15.39,51.14) 15.3,51.14 14.41,52.03
  Bottom Layer w0.152: v3(15.39,44.89) v3(15.39,51.14)
LD2: length 15.6
  Top Layer w0.152: U6.11 6.35,43.77 7.06,44.48 12.09,44.48 12.34,44.23 13.92,44.23 v3(14.53,44.84) ; 14.43,50.15 14.48,50.1 v3(14.48,49.26)
  Bottom Layer w0.152: v3(14.48,49.26) 14.53,49.21 v3(14.53,44.84)
LD3: length 13.6
  Top Layer w0.152: LD3.2 13.72,47.48 v3(13.72,47.33) ; v3(13.72,44.84) 6.55,44.84 5.85,44.14 U6.12
  Bottom Layer w0.152: v3(13.72,44.84) v3(13.72,47.33)
LD4: length 17.7
  Top Layer w0.152: U6.19 5.23,37.88 5.64,38.29 5.64,41.18 5.23,41.59 5.23,44.38 6.15,45.3 13.46,45.3 14.43,46.27
M-ATLK_RX: length 12
  Top Layer w0.152: 12.88,23.94 12.88,24.77 8.43,29.22 8.43,31.79 8.85,32.2 U6.31
M-ATLK_TX: length 11.4
  Top Layer w0.152: 11,23.94 11,24.8 7.92,27.88 7.92,31.89 8.35,32.31 U6.30
M-BOOT0: length 3.9
  Top Layer w0.152: J9.2 14.66,38.88 U6.44
M-NRST: length 24.3
  Top Layer w0.152: v3(11.99,32.8) 11.99,34.89 8.5,38.38 8.5,40.15 8.35,40.3 U6.7 8.35,43.23 v3(8.74,43.62)
  Bottom Layer w0.152: P1.4 13,25.75 13,31.78 v3(11.99,32.8) ; v3(8.5,39.92) 8.52,39.9 C22.2
M-SWCLK: length 11.4
  Top Layer w0.152: U6.37 13.67,35.38 v3(14.12,34.93)
  Bottom Layer w0.152: v3(14.12,34.93) 14.12,33.11 13.66,32.65 13.66,27.63 P1.3
M-SWDIO: length 7.9
  Top Layer w0.152: P1.2 14.65,28.46 10.35,32.76 U6.34
M-USB_DM: length 41.1
  Top Layer w0.152: R38.2 9.19,62.68 9.19,62.29 9.35,62.14 v3(9.35,61.91) ; v3(9.3,31.58) 9.55,31.83 9.55,32.75 9.35,32.94 U6.32
  Bottom Layer w0.152: v3(9.35,61.91) 9.35,61.65 9.14,61.45 9.14,53.83 4.45,49.14 4.45,32.8 6.17,31.07 8.79,31.07 v3(9.3,31.58)
M-USB_DP: length 42.2
  Top Layer w0.152: v3(8.69,61.91) 8.69,62.16 8.89,62.36 8.89,62.63 R37.2 ; v3(9.4,30.92) 9.85,31.37 U6.33
  Bottom Layer w0.152: v3(9.4,30.92) 9.24,30.77 6.04,30.77 4.14,32.67 4.14,49.26 8.84,53.96 8.84,61.49 8.69,61.64 v3(8.69,61.91)
NRST/PF2: length 174.4
  Top Layer w0.152: J4.3 49.7,12.52 55.09,12.52 56.84,10.76 56.84,7.95 J2.7 ; v2(35.34,11.24) 35.34,10.01 B1.2 B1.1 ; 47.96,22.47 v2(50.69,22.47) 50.71,22.45 v2(67.31,22.45) ; 47.96,22.47 33.12,22.47 32.41,23.18 30.55,23.18 29.29,21.92 CN2.7 25.77,21.92 23.35,19.5 17.45,19.5 v3(14.4,16.45) ; 47.96,22.47 v3(47.95,22.47) ; v2(67.59,36.42) 68.12,36.96 78.64,36.96 J7.5 ; v3(10.23,8.1) 10.23,16.42 v3(10.26,16.45) 10.26,20.44 9.2,21.51 9.2,22.34 9.12,22.42 ; U8.7 52.39,40.52 51.68,39.82 51.68,38.84 C5.2 50.69,37.72 v2(50.69,36.06)
  Bottom Layer w0.152: v3(10.26,16.45) 14.39,16.45 v3(14.4,16.45) ; v2(67.59,36.42) 67.59,22.73 v2(67.31,22.45) ; v2(35.34,11.24) 35.34,14.42 32.54,17.22 30.94,17.22 29.91,18.26 29.91,20.66 CN2.7 ; v3(10.23,8.1) 6.66,4.53 CN7.7 ; v2(50.69,36.06) 50.69,22.48 ; J4.3 v3(47.95,22.47)
PA0: length 64.4
  Top Layer w0.152: J6.1 65.73,12.87 64.34,11.48 62.91,11.48 J2.10 ; 38.17,15.84 39.93,17.6 v2(54.06,17.6) ; U8.10 v3(53.11,39.02)
  Bottom Layer w0.152: J2.10 60.65,11.69 61.96,13 61.96,15.66 60.08,17.55 54.06,17.55 ; 54.06,17.55 v2(54.06,17.6) ; 54.06,17.55 54.05,17.54 52.45,19.14 52.45,38.36 v3(53.11,39.02)
PA1: length 52.3
  Top Layer w0.152: v3(53.3,38.29) 53.53,38.52 U8.11 ; J2.11 64.45,7.93 64.45,10.39 66.31,12.25 67.7,12.25 68.27,12.83 J6.2
  Bottom Layer w0.152: v3(53.3,38.29) 52.94,37.94 52.94,19.54 54.43,18.06 60.77,18.06 62.56,16.27 62.56,10.82 61.91,10.16 61.91,7.97 J2.11
PA2: length 91.9
  Top Layer w0.152: U8.12 53.9,38.02 v3(53.48,37.6) ; v3(53.51,29.33) 53.53,29.31 v3(73.18,29.31)
  Bottom Layer w0.152: J2.12 63.19,16.84 61.47,18.56 54.79,18.56 53.48,19.87 53.48,29.25 ; v3(53.51,29.33) 53.51,29.28 53.48,29.25 ; 53.48,29.25 v3(53.48,37.6) ; v3(73.18,29.31) 74.17,30.3 74.17,59.06 75.89,60.78 J5.2
PA3: length 84.4
  Top Layer w0.152: v3(75.38,29.84) 75.36,29.86 61.4,29.86 v2(61.39,29.85) 61.39,29.85 61.4,29.86 56.84,29.86 56.27,30.43 U8.13
  Bottom Layer w0.152: v3(75.38,29.84) 75.95,30.41 75.95,58.09 78.43,60.57 J5.1 ; J2.13 64.47,7.94 64.47,10.76 63.82,11.41 63.82,17.26 61.39,19.69 v2(61.39,29.85)
PA4: length 42
  Top Layer w0.152: J2.14 68.02,11.5 69.93,11.5 70.81,12.38 J6.3 ; v2(62.05,30.4) 57.42,30.4 56.77,31.06 U8.14
  Bottom Layer w0.152: J2.14 65.73,11.06 64.46,12.33 64.46,17.53 62.05,19.94 v2(62.05,30.4)
PA5: length 68.7
  Top Layer w0.152: v3(62.68,30.99) 57.89,30.99 57.27,31.61 U8.15 57.27,42.06 v3(56.21,43.12)
  Bottom Layer w0.152: v3(56.21,43.12) 55.92,43.41 55.92,50.49 J3.6 ; J2.15 68.27,6.75 67.12,7.91 67.12,10.48 66.96,10.64 66.96,13.05 66.89,13.11 66.89,16.04 62.69,20.25 62.69,30.98 v3(62.68,30.99)
PA6: length 74.7
  Top Layer w0.152: v2(64.93,18.92) 64.96,18.95 v2(72.82,18.95) ; v3(57.72,42.31) 57.77,42.26 U8.16 57.77,32.49 58.72,31.54 63.25,31.54 v3(63.27,31.52)
  Bottom Layer w0.152: v2(72.82,18.95) 74.64,18.95 74.64,18.94 ; v3(63.27,31.52) 63.27,20.58 v2(64.93,18.92) 67.2,16.65 67.2,13.24 68.27,12.16 J2.16 ; J3.5 46.43,60.73 56.36,50.8 56.36,43.67 v3(57.72,42.31)
PA7: length 68
  Top Layer w0.152: v3(57.14,43.6) 58.27,42.48 U8.17 58.27,33.02 59.18,32.11 64.56,32.11 v3(65.09,31.58)
  Bottom Layer w0.152: J2.17 69.51,7.99 69.51,10.32 69.32,10.51 69.32,15.52 65.09,19.75 v3(65.09,31.58) ; J3.4 48.97,58.97 56.79,51.15 56.79,43.96 v3(57.14,43.6)
PA8: length 52.9
  Top Layer w0.152: 63.27,40.02 72.3,40.02 v3(72.95,40.67) ; v2(72.93,59.18) 72,60.1 63.91,60.1 63.19,60.81 63.19,62.52
  Bottom Layer w0.152: v3(72.95,40.67) 72.95,59.16 v2(72.93,59.18) 73,59.18 74.8,60.98 74.8,65.43 74.61,65.61 74.61,68.87 73.35,70.13
PA9/USART1_TX: length 121.9
  Top Layer w0.152: 63.27,40.52 68.82,40.52 v3(68.83,40.53) ; v2(68.43,21.41) 68.41,21.4 38.09,21.4 v2(37.01,20.32) ; J3.1 56.59,60.43 57.94,59.08 68.35,59.08 70.06,57.37 v3(71.53,57.37) 71.55,57.35 J8.2
  Bottom Layer w0.152: 73.35,67.59 73.35,65.36 74.41,64.3 74.41,61.51 73.81,60.91 72.86,60.91 71.53,59.58 v3(71.53,57.37) 71.53,54.62 68.83,51.91 v3(68.83,40.53) 68.83,21.83 ; 36.91,20.16 36.15,19.4 ; 68.83,21.83 68.83,21.81 v2(68.43,21.41) ; 68.83,21.83 68.83,21.82
PA10/USART1_RX: length 104.3
  Top Layer w0.152: v3(68.22,22.35) 67.78,21.91 v3(37.6,21.91) ; 63.27,41.02 68.19,41.02 v3(68.22,41.05) ; J8.3 86.89,54.86 v2(70.81,54.86)
  Bottom Layer w0.152: v3(68.22,22.35) 68.22,41.05 v3(68.22,41.05) 68.22,52.25 70.81,54.83 v2(70.81,54.86) 70.81,59.66 73.35,62.21 73.35,64.16 72.22,65.28 72.22,68.72 J1.7 ; v3(37.6,21.91) R15.1
PA11: length 31.5
  Top Layer w0.152: 63.27,41.52 67.16,41.52 v3(67.43,41.79)
  Bottom Layer w0.152: J1.8 70.81,65.74 69.72,64.65 69.72,60.54 67.75,58.56 67.75,42.11 v3(67.43,41.79)
PA12: length 33.3
  Top Layer w0.152: v3(67.24,42.52) 66.74,42.02 63.27,42.02
  Bottom Layer w0.152: J1.9 69.54,68.87 69.54,66.79 69.33,66.58 69.33,60.8 67.23,58.7 67.23,42.53 67.24,42.53
PA13/SWDIO: length 127.8
  Top Layer w0.152: v3(20.48,26.33) 21.15,27 CN2.3 29.93,28.29 32.52,28.29 32.98,28.75 v3(63.84,28.75) ; R44.2 5.37,21.64 8.03,18.98 v3(8.69,18.98) 8.69,7.18 CN7.3 ; v3(66.16,42.57) 66.11,42.52 63.27,42.52
  Bottom Layer w0.152: v3(63.84,28.75) 63.84,35.29 66.16,37.61 v3(66.16,42.57) ; v3(8.69,18.98) 16.66,18.98 17.42,19.75 20.08,19.75 20.48,20.15 v3(20.48,26.33) ; 66.16,42.57 66.16,47.6 66.57,48.01 66.57,60.2 67.21,60.84 67.21,66.53 J1.10
PA14/SWCLK: length 136.2
  Top Layer w0.152: v3(66.69,46.62) 66.44,46.87 v3(61.77,46.87) 61.77,45.02 ; R41.2 3.49,22 v3(7.87,17.61) 7.87,6.64 9.2,5.32 CN7.5 ; v3(21.71,23.65) 22.52,24.46 CN2.5 29.32,24.46 30.58,25.72 32.22,25.72 34.2,27.7 64.35,27.7
  Bottom Layer w0.152: v3(7.87,17.61) 16.83,17.61 17.95,18.73 20.66,18.73 21.71,19.77 v3(21.71,23.65) ; v3(64.35,27.7) 64.35,35.17 66.69,37.51 v3(66.69,46.62) ; v3(61.77,46.87) 61.77,60.02 62.23,60.48 63.59,60.48 64.27,61.17 64.27,65.97 64.46,66.15 64.46,68.87 63.19,70.13
PA15: length 31.6
  Top Layer w0.152: v3(53.97,57.91) v3(61.27,57.91) ; U8.38 v3(61.27,47.44)
  Bottom Layer w0.152: 63.19,67.59 63.19,65.67 62.08,64.56 62.08,60.98 61.27,60.16 v3(61.27,47.44) ; 53.01,57.91 v3(53.97,57.91)
PB0: length 41.6
  Top Layer w0.152: J2.18 73.35,11.76 J6.4 ; U8.18 58.77,33.59 59.69,32.66 65.22,32.66 65.69,32.19
  Bottom Layer w0.152: J2.18 70.81,12.24 69.69,13.37 69.69,15.88 65.69,19.88 v3(65.69,32.19)
PB1: length 52.2
  Top Layer w0.152: v2(69.34,20.45) 79.19,20.45 v2(79.77,19.86) ; U8.19 59.27,34.46 60.57,33.16 69.01,33.16 v3(69.33,32.84)
  Bottom Layer w0.152: v2(79.77,19.86) 79.81,19.82 79.81,18.94 ; v3(69.33,32.84) 69.34,32.83 v2(69.34,20.45) 69.34,18.67 71.88,16.13 71.88,10.95 72.09,10.74 72.09,7.95 J2.19
PB2: length 38
  Top Layer w0.152: 59.77,36.52 59.77,34.79 60.91,33.65 69.51,33.65 v3(70.07,33.09)
  Bottom Layer w0.152: J2.20 73.35,12.21 72.31,13.25 72.31,16.41 70.05,18.67 70.05,33.07 v3(70.07,33.09)
PB3: length 82.2
  Top Layer w0.152: J1.15 60.87,70.13 62.12,68.88 63.69,68.88 64.53,68.04 64.53,66.47 65.94,65.05 67.59,65.05 68.27,64.37 J5.5 ; v2(37.21,24.45) 39.95,27.19 v2(60.3,27.19) ; v3(60.77,46.85) U8.39 v3(60.77,43.68)
  Bottom Layer w0.152: v2(60.3,27.19) 60.77,27.66 v3(60.77,43.68) ; J1.15 60.65,69.71 61.9,68.47 61.9,66.24 61.75,66.09 61.75,61.21 60.77,60.24 v3(60.77,46.85) ; v2(37.21,24.45) 37.2,24.45 R14.1
PB4: length 31.5
  Top Layer w0.152: J5.6 65.73,63.89 64.82,64.8 63.44,64.8 J1.16 ; U8.40 60.28,45.03 v3(60.28,47.4)
  Bottom Layer w0.152: J1.16 60.65,67.13 59.31,65.78 59.31,61.41 60.28,60.44 v3(60.28,47.4)
PB5: length 47.5
  Top Layer w0.152: 59.77,45.02 59.77,46.82 ; J5.4 70.81,63.95 69.51,65.25 69.51,70.76 68.49,71.79 59.77,71.79 J1.17
  Bottom Layer w0.152: J1.17 59.38,68.86 59.38,66.63 58.9,66.14 58.9,61.11 59.77,60.24 v3(59.77,46.83)
PB6: length 32
  Top Layer w0.152: v2(59.27,56.08) 52.61,56.08 v3(52.24,56.45) ; U8.42 v3(59.27,47.42)
  Bottom Layer w0.152: v3(52.24,56.45) 51.5,57.19 51.5,57.94 ; v3(59.27,47.42) v2(59.27,56.08) 59.27,59.62 58.39,60.5 58.39,67.32 J1.18
PB10: length 69.8
  Top Layer w0.152: v3(61.98,39.29) 60.27,37.57 U8.21 60.27,35.03 61.18,34.12 70,34.12 v3(70.05,34.07) ; J5.8 60.65,61.44 v3(62.41,59.68)
  Bottom Layer w0.152: v3(62.41,59.68) 62.41,47.36 63.25,46.53 63.25,44.4 62.43,43.58 62.43,39.73 61.98,39.28 ; J2.21 74.64,7.94 74.64,12.07 74.41,12.29 74.41,15.1 70.64,18.87 70.64,33.49 v3(70.05,34.07)
PB11: length 50.5
  Top Layer w0.152: J7.8 80.06,35.89 72.42,35.89 v3(71.13,34.6) 71.11,34.58 61.48,34.58 60.77,35.29 U8.22
  Bottom Layer w0.152: v3(71.13,34.6) 71.13,19.01 74.79,15.35 74.79,12.87 75.89,11.76 J2.22
PB12: length 52
  Top Layer w0.152: 63.27,38.02 77.13,38.02 v3(77.14,38.03)
  Bottom Layer w0.152: J1.1 80.11,68.45 80.11,60.28 77.13,57.29 77.13,38.04 v3(77.14,38.03) 77.14,36.27 J7.7
PB13: length 45.6
  Top Layer w0.152: J7.3 78.79,39.7 v3(76.51,39.7) 75.33,38.52 63.27,38.52
  Bottom Layer w0.152: J1.2 79.51,66.51 79.51,60.62 76.51,57.62 v3(76.51,39.7)
PB14: length 47.8
  Top Layer w0.152: v3(75.36,42.22) 78.81,42.22 J7.1 ; v3(74.9,39.07) 74.85,39.02 63.27,39.02
  Bottom Layer w0.152: J1.3 75.89,69.73 77.16,68.46 77.16,66.19 77.32,66.03 77.32,60.36 75.37,58.42 75.37,39.54 v3(74.9,39.07)
PB15: length 47.2
  Top Layer w0.152: J7.4 80.16,40.87 v3(74.78,40.87) 73.43,39.52 63.27,39.52
  Bottom Layer w0.152: J1.4 75.89,65.87 76.95,64.81 76.95,60.93 74.76,58.74 74.76,40.89 v3(74.78,40.87)
PC13: length 73.9
  Top Layer w0.152: v3(36.93,46.4) 38.33,47.79 49.84,47.79 49.96,47.68 50.86,47.68 50.98,47.79 52.04,47.79 53.24,46.59 53.24,43.75 53.96,43.02 U8.2 ; 38.21,14.52 39.19,14.52 39.65,14.06 39.65,12.91 v2(40.92,11.63) 48.34,11.63 50.49,9.48 J2.2
  Bottom Layer w0.152: v3(36.93,46.4) 36.93,28.61 40.44,25.1 40.44,12.12 v2(40.92,11.63)
PC14: length 62.1
  Top Layer w0.152: 42.28,12.14 48.52,12.14 49.9,10.76 50.98,10.76 51.73,10.01 51.73,7.98 J2.3 ; v3(38.2,45.96) 38.81,46.58 v3(49,46.58)
  Bottom Layer w0.152: v3(49,46.58) 49.03,46.6 50.07,46.6 ; v2(42.28,12.15) 41.59,12.84 41.59,25.21 37.93,28.87 37.93,45.69 v3(38.2,45.96)
PC15: length 63.8
  Top Layer w0.152: J2.4 53.03,9.51 51.24,11.3 50.11,11.3 48.77,12.64 40.99,12.64 v2(40.96,12.61) ; v2(38.12,46.83) 38.6,47.31 v2(51.35,47.31)
  Bottom Layer w0.152: v2(38.12,46.83) 37.47,46.18 37.47,28.7 40.96,25.21 v2(40.96,12.61) ; v2(51.35,47.31) 51.37,47.3 51.37,46.62
PF0: length 34.2
  Bottom Layer w0.152: J2.5 54.26,7.99 54.26,10 51.55,12.71 51.55,15.29 48.52,18.32 48.52,38.01
PF1: length 31.8
  Bottom Layer w0.152: 49.92,38.04 49.92,37.63 49.1,36.81 49.1,18.62 51.93,15.79 51.93,13.24 55.57,9.59 J2.6
PF6: length 48.2
  Top Layer w0.152: v3(65.22,43.02) 63.27,43.02 63.27,43.02 ; v3(65.72,48.58) 63.61,48.58 61.62,50.57 51.03,50.57 50.43,49.97 48.92,49.97
  Bottom Layer w0.152: 65.73,48.58 65.73,43.53 v3(65.22,43.02) ; 65.73,48.58 65.73,59.96 66.84,61.06 66.84,66.7 66.99,66.85 66.99,68.88 J1.11 ; 65.73,48.58 v3(65.72,48.58)
PF7: length 43.7
  Top Layer w0.152: v3(65.14,49.18) 63.87,49.18 62.02,51.03 49.87,51.03 48.95,51.95 ; 63.27,43.52 v3(64.73,43.52)
  Bottom Layer w0.152: v3(64.73,43.52) 65.14,43.93 65.14,49.18 ; 65.14,49.18 65.14,60.33 64.66,60.81 64.66,65.54 65.73,66.61 J1.12 ; 65.14,49.18 v3(65.14,49.18)
PF8: length 79.7
  Top Layer w0.152: v3(50.46,52.85) 49.22,54.08 48.9,54.08 ; v2(39.91,11.69) 40.45,11.14 48,11.14 48.91,10.23 48.91,8.26 J2.1 ; 54.77,43.52 54.08,43.52 53.67,43.93 53.67,46.76 52.22,48.22 50.45,48.22 ; v2(37.08,47.45) 37.85,48.22 50.45,48.22 ; v3(50.46,48.23) 50.45,48.22
  Bottom Layer w0.152: v3(50.46,52.85) 50.46,48.23 ; v2(37.08,47.45) 36.27,46.64 36.27,28.54 39.9,24.91 39.9,11.69 v2(39.91,11.69)
PF9: length 38
  Top Layer w0.152: U8.8 52.66,40.02 v3(52.33,39.69)
  Bottom Layer w0.152: J2.8 58.11,11.87 56.94,13.04 56.94,15.8 56.1,16.64 52.91,16.64 51.45,18.11 51.45,38.82 v3(52.33,39.69)
PF10: length 41.4
  Top Layer w0.152: U8.9 52.84,39.52 v3(52.3,38.97)
  Bottom Layer w0.152: v3(52.3,38.97) 51.98,38.66 51.98,18.48 53.38,17.08 57.93,17.08 59.42,15.59 59.42,7.91 J2.9
PF11/BOOT0: length 146.4
  Top Layer w0.152: v2(58.27,54.97) 58.17,55.07 R17.1 ; v3(21.11,25.28) 21.53,25.7 29.88,25.7 CN2.4 32.39,27 33.57,28.18 v3(60.07,28.18) ; CN7.4 12.98,2.83 12.98,4.57 9.55,8.01 v3(9.55,18.33) 9.55,19.39 7.25,21.69 R45.2 ; v3(60.07,38.79) 60.07,42.45 58.27,44.25 U8.44 v3(58.27,47.57)
  Bottom Layer w0.152: 55.57,67.59 55.57,65.95 55.49,65.87 55.49,61.09 58.27,58.3 v3(58.27,47.57) ; v3(9.55,18.33) 9.55,18.32 16.72,18.32 17.7,19.3 20.36,19.3 21.11,20.05 v3(21.11,25.28) ; v3(60.07,28.18) 60.07,28.19 v3(60.07,38.79)
PF12: length 42.9
  Top Layer w0.152: U8.23 61.27,35.63 61.8,35.1 65.4,35.1 v3(65.41,35.1) ; v2(70.22,16.19) 76.77,16.19 v2(76.86,16.1)
  Bottom Layer w0.152: v2(70.22,16.19) 66.27,20.14 66.27,34.24 v3(65.41,35.1) ; v2(76.86,16.1) 76.86,10.34 77.15,10.05 77.15,7.97 J2.23
PF13: length 40.6
  Top Layer w0.152: v2(70.23,17.04) 76.86,17.04 v2(77.47,16.43) ; 61.77,36.52 61.77,35.87 62.08,35.56 65.02,35.56 65.18,35.71 65.9,35.71 v3(66.29,35.32)
  Bottom Layer w0.152: v2(77.47,16.43) 77.47,11.18 77.44,11.15 77.44,10.21 J2.24 ; v2(70.23,17.04) 66.75,20.52 66.75,34.86 v3(66.29,35.32)
SWO: length 62.9
  Top Layer w0.152: R52.2 3.48,28.37 3.48,26.11 2.57,25.2 2.57,21.08 6.88,16.78 ; 6.88,16.78 6.91,16.75 6.91,6.26 7.93,5.24 7.93,2.86 CN7.6 ; 6.88,16.78 6.86,16.76 v3(6.86,16.75) ; v3(22.29,22.7) 22.76,23.17 29.89,23.17 CN2.6
  Bottom Layer w0.152: R14.2 31.2,24.45 CN2.6 ; v3(22.29,22.7) 22.29,19.25 21.29,18.26 18.1,18.26 16.9,17.06 9.17,17.06 8.87,16.75 v3(6.86,16.75)
USBM: length 8.1
  Top Layer w0.152: R38.1 9.8,65.62 v3(9.19,66.23) 9.02,66.4 9.02,67.68 ; 9.02,67.68 9.78,67.68 10.02,67.91 CN6.B7 ; 9.02,67.68 CN6.A7
  Bottom Layer w0.152: TP3.2 9.96,66.23 v3(9.19,66.23)
USBP: length 9.3
  Top Layer w0.152: R37.1 8.69,65.25 v3(8.69,65.72) 8.69,67.68 8.52,67.84 CN6.B6 8.53,69.13 8.53,70.34 8.79,70.6 9.24,70.6 9.52,70.32 CN6.A6
  Bottom Layer w0.152: v3(8.69,65.72) 7.92,65.72 TP3.3
$1N792: length 2.9
  Top Layer w0.152: RP1.8 11.08,50.26 12.86,52.03
$1N793: length 2.5
  Top Layer w0.152: 12.88,50.15 12.07,50.15 11.37,49.46 RP1.7
$1N794: length 2.4
  Top Layer w0.152: RP1.6 11.63,48.66 12.08,48.2 LD3.1
$1N795: length 2.9
  Top Layer w0.152: RP1.5 11.26,47.86 12.85,46.27 12.88,46.27
$1N16959: length 22.3
  Top Layer w0.152: 4.21,63.28 4.19,63.26 U5.3 ; C15.2 13.49,63.21 U7.3
  Top Layer w0.381: U5.1 6.09,63.27 6.09,63.28 ; 4.21,63.28 C19.2 ; 4.21,63.28 6.09,63.28 ; 4.21,63.28 v1(3.1,63.28) ; 6.09,63.28 C18.2 ; 15.48,63.34 C15.2 11.79,63.34 F2.2 10.83,63.29 v1(10.82,63.28) ; C16.2 15.48,61.72 U7.1
  Bottom Layer w0.381: v1(10.82,63.28) v1(3.1,63.28)
$1N17598: length 3.7
  Top Layer w0.508: R49.1 13.3,59.28 U7.4 13.49,58.17 13.61,58.05 13.61,57.4 R43.2
$1N17675: length 3.6
  Top Layer w0.508: R50.2 4.19,57.57 U5.4 2.62,59.09 R51.1
$2N438: length 4.4
  Top Layer w0.152: 49.36,43.83 49.31,43.77 Y1.2 47.18,43.84 C2.2
$2N5937: length 9
  Top Layer w0.152: 54.77,41.52 51.61,41.52 v3(51.56,41.57) 51.01,41.57 50.59,42 50.59,42.01
  Bottom Layer w0.152: v3(51.56,41.57) 49.85,41.57 48.52,40.24 48.52,39.22
$2N5955: length 7.1
  Top Layer w0.152: 50.57,40.68 50.68,40.79 51.53,40.79 v3(51.57,40.75) 51.84,41.02 U8.6
  Bottom Layer w0.152: v3(51.57,40.75) 50.65,40.75 49.92,40.03 49.92,39.26
$2N5975: length 4.4
  Top Layer w0.152: 49.38,45.12 49.23,45.27 Y1.1 47.25,45.26 C1.2
$2N6104: length 7.6
  Top Layer w0.152: U8.3 53.54,42.52 v3(51.69,44.38) 50.94,45.12 50.6,45.12
  Bottom Layer w0.152: 50.07,45.39 50.07,44.83 50.53,44.38 v3(51.69,44.38)
$2N6111: length 7.8
  Top Layer w0.152: 50.58,43.83 51.42,43.83 v3(52.29,42.95) 53.22,42.02 U8.4
  Bottom Layer w0.152: v3(52.29,42.95) 52.29,44.47 51.37,45.4
$2N6210: length 7.8
  Top Layer w0.152: 49.37,42.01 48.67,42.01 48.26,41.61 48.26,40.74 47.85,40.34 46.18,40.34 45.23,41.29 Y2.3 45.18,41.39 43.28,41.39
$2N6248: length 5.3
  Top Layer w0.152: C4.2 46.93,37.08 46.93,39.24 47.91,39.24 49.35,40.68
$2N7510: length 2.9
  Top Layer w0.152: JP1.2 33.19,55.03 R17.2
$3N526: length 1.6
  Top Layer w0.152: LED1.1 29.62,41.7 R3.1
$3N6624: length 10.5
  Top Layer w0.152: U2.5 25.58,39.6 26.21,38.96 27.73,38.96 27.88,38.81 29.35,38.81 R1.1
  Top Layer w0.508: U2.5 25.58,43.14 C26.1 25.63,43.66 25.08,44.22 D2.2
$3N6989: length 1.9
  Top Layer w0.152: R21.1 47.35,49.99 47.37,49.97
$3N7005: length 2
  Top Layer w0.152: 47.4,51.95 47.38,51.97 R22.1
$3N7010: length 1.9
  Top Layer w0.152: 47.35,53.92 47.33,53.94 R23.1
$3N7265: length 4.4
  Top Layer w0.152: U2.4 27.6,40.09 R2.1 31.15,38.57 R1.2
$3N7356: length 19.5
  Top Layer w0.152: 36.95,15.84 36.99,15.8 36.99,13.21 R20.1 36.83,13.01 v2(36.83,11.88) ; v2(37.96,6.58) 37.96,5.94 B2.2 B2.1
  Bottom Layer w0.152: v2(37.96,6.58) 36.83,7.7 v2(36.83,11.88)
$3N14088: length 2.5
  Top Layer w0.152: U9.4 76.58,23.7 R4.2
$3N14090: length 5.6
  Bottom Layer w0.254: SW1.2 88.6,20.07 R30.1
$4N2984: length 5
  Bottom Layer w0.152: 75.85,17.72 74.38,17.72 74.36,17.74 ; 75.85,17.72 75.87,17.74 ; 75.85,17.72 75.85,14.3 J6.5
$4N3391: length 5.1
  Bottom Layer w0.152: J6.6 78.43,17.63 78.31,17.75 79.78,17.75 79.81,17.72
$4N3469: length 4.9
  Bottom Layer w0.152: 53.01,59.13 51.71,59.13 51.51,59.34 ; J3.3 51.51,59.34 ; 51.51,59.34 51.51,59.17 51.5,59.16

## Copper pours and planes (outline as drawn; the poured copper is in the pictures)
GND on Top Layer: -0.82,77.54 95.06,77.54 95.06,-0.84 -0.82,-0.84
GND on Bottom Layer: -1.27,77.19 95.02,77.19 95.02,-1.64 -1.27,-1.64

Small or netless copper shapes (teardrops, artwork), in the pictures only: 596 on Top Layer, 345 on Bottom Layer

## Text on the board
Bottom Silkscreen Layer: M-SWDIO | M-SWCLK | M-NRST | VDD | GND | 2 | 48 | 47 | 3 | 4 | 46 | 45 | 5 | 6 | 44 | 43 | 7 | 8 | 42 | 41 | 9 | 10 | 40 | 39 | 11 | 38 | 12 | 37 | 13 | 36 | 14 | 35 | 15 | 34 | 16 | 33 | 17 | 32 | 18 | 31 | 19 | 30 | 20 | 29 | 21 | 28 | 22 | 27 | 23 | 26 | 24 | 25 | 1 | AT32M416CBT7
Top Silkscreen Layer: BOOT0 / /F11 | NRST / /F2 | C15* | C14* | F0* | F1* | 25 | 3 | 2 | 4 | 1 | 47 | 41 | 11 | 31 | 21 | 23 | B10 | PF12 | LD: | BOOT0 | C13 | A15 | A13 | B15 | B13 | VDD | GND | F8 | B8 | B9 | B7 | B5 | F9 | B6 | A0 | B3 | F10 | B4 | A14 | A2 | A1 | A4 | F6 | A3 | F7 | A12 | A6 | A5 | A10 | B0 | A11 | A7 | A8 | B2 | A9 | B1 | B14 | B11 | F13 | B12 | RX | NRST | TX | SWC | SWO | SWD | E5V | 3V3 | SWCLK | SWDIO | USART1_RX | USART1_TX | USART1 | 8 | 7 | RESET | USER | MISO | SCK | NSS | 5V | PB11 | MOSI | SCL | SDA | VDDA | 13 | IOREF | 12 | #11 | 3.3V | #10 | #9 | VIN | #6 | AN0 | #5 | AN1 | AN2 | #3 | AN3 | AN4 | TX 1 | AN5 | RX 0 | 120Ω | H | L | IDD | CAN1 | DIGITAL(#=PWM) | POWER | ANALOG IN | AT-Link | AT-Link-EZ V1.4 | AT-START-M416 V1.1
